# Altium schematic sheet lpf.SchDoc: Low Pass Filter
size Letter; CheckedBy: J. Brinton; CompanyName: Signal Laboratories, Inc.; DrawnBy: J. Brinton; Engineer: J. Brinton; Address1: 3479 Edison Way; Address2: Menlo Park CA 94025; Address3: +1 (877) 778-8435; Address4: siglabs.com; Revision: 3; SheetNumber: 9; SheetTotal: 45
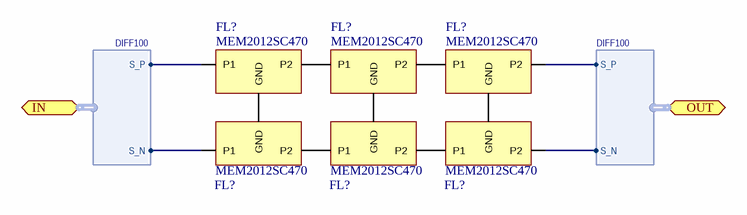
[diagram p0: lpf.SchDoc]

## Parts
(Parts that share a designator on the sheet are numbered #1, #2 ... from top to bottom, then left to right.)
FL?#1  MEM2012SC470  [FIL_MEM2012SC470_MEM2012SC470(Primary)]
FL?#2  MEM2012SC470  [FIL_MEM2012SC470_MEM2012SC470(Primary)]
FL?#3  MEM2012SC470  [FIL_MEM2012SC470_MEM2012SC470(Primary)]
FL?#4  MEM2012SC470  [FIL_MEM2012SC470_MEM2012SC470(Primary)]
FL?#5  MEM2012SC470  [FIL_MEM2012SC470_MEM2012SC470(Primary)]
FL?#6  MEM2012SC470  [FIL_MEM2012SC470_MEM2012SC470(Primary)]

## Ports
IN (harness DIFF100), OUT (harness DIFF100)

## Harnesses
DIFF100: S_P, S_N

## Nets
NetFL?#1_1: FL?#1.1(P1) ; port IN.S_P
NetFL?#1_2_5: FL?#1.2_5(GND) FL?#4.2_5(GND)
NetFL?#1_3: FL?#1.3(P2) FL?#2.1(P1)
NetFL?#2_2_5: FL?#2.2_5(GND) FL?#5.2_5(GND)
NetFL?#2_3: FL?#2.3(P2) FL?#3.1(P1)
NetFL?#3_2_5: FL?#3.2_5(GND) FL?#6.2_5(GND)
NetFL?#3_3: FL?#3.3(P2) ; port OUT.S_P
NetFL?#4_1: FL?#4.1(P1) ; port IN.S_N
NetFL?#4_3: FL?#4.3(P2) FL?#5.1(P1)
NetFL?#5_3: FL?#5.3(P2) FL?#6.1(P1)
NetFL?#6_3: FL?#6.3(P2) ; port OUT.S_N

## Notes on the sheet
- Title
- Engineer
- Revision
- Drawn By
- Checked By
- Date
- Sheet
- of

## Library data of the parts
FL?#1-FL?#6 = MEM2012SC470: EMI Filter 1A 12V Flat Style SMD Punched Paper T/R; MF: TDK; Package: 0805 TDK; MP: MEM2012SC470; Availability: Good; Price: 0.30 USD; SnapEDA_Link: https://www.snapeda.com/symbols-footprints/MEM2012SC470/TDK/view-part/?ref=snap; Value: *